# EasyEDA Pro project AT32M412_EVB.eprj, schematic Schematic1

## Sheets
1 PWR: Board Name: AT32M412_EVB; Create Date: 2025-06-04; Page Name: PWR; Project Name: AT32M412_EVB; Schematic Name: Schematic1; Update Date: 2025-11-24; Company: 嘉立创EDA; Page Size: A4; Version: V1.0
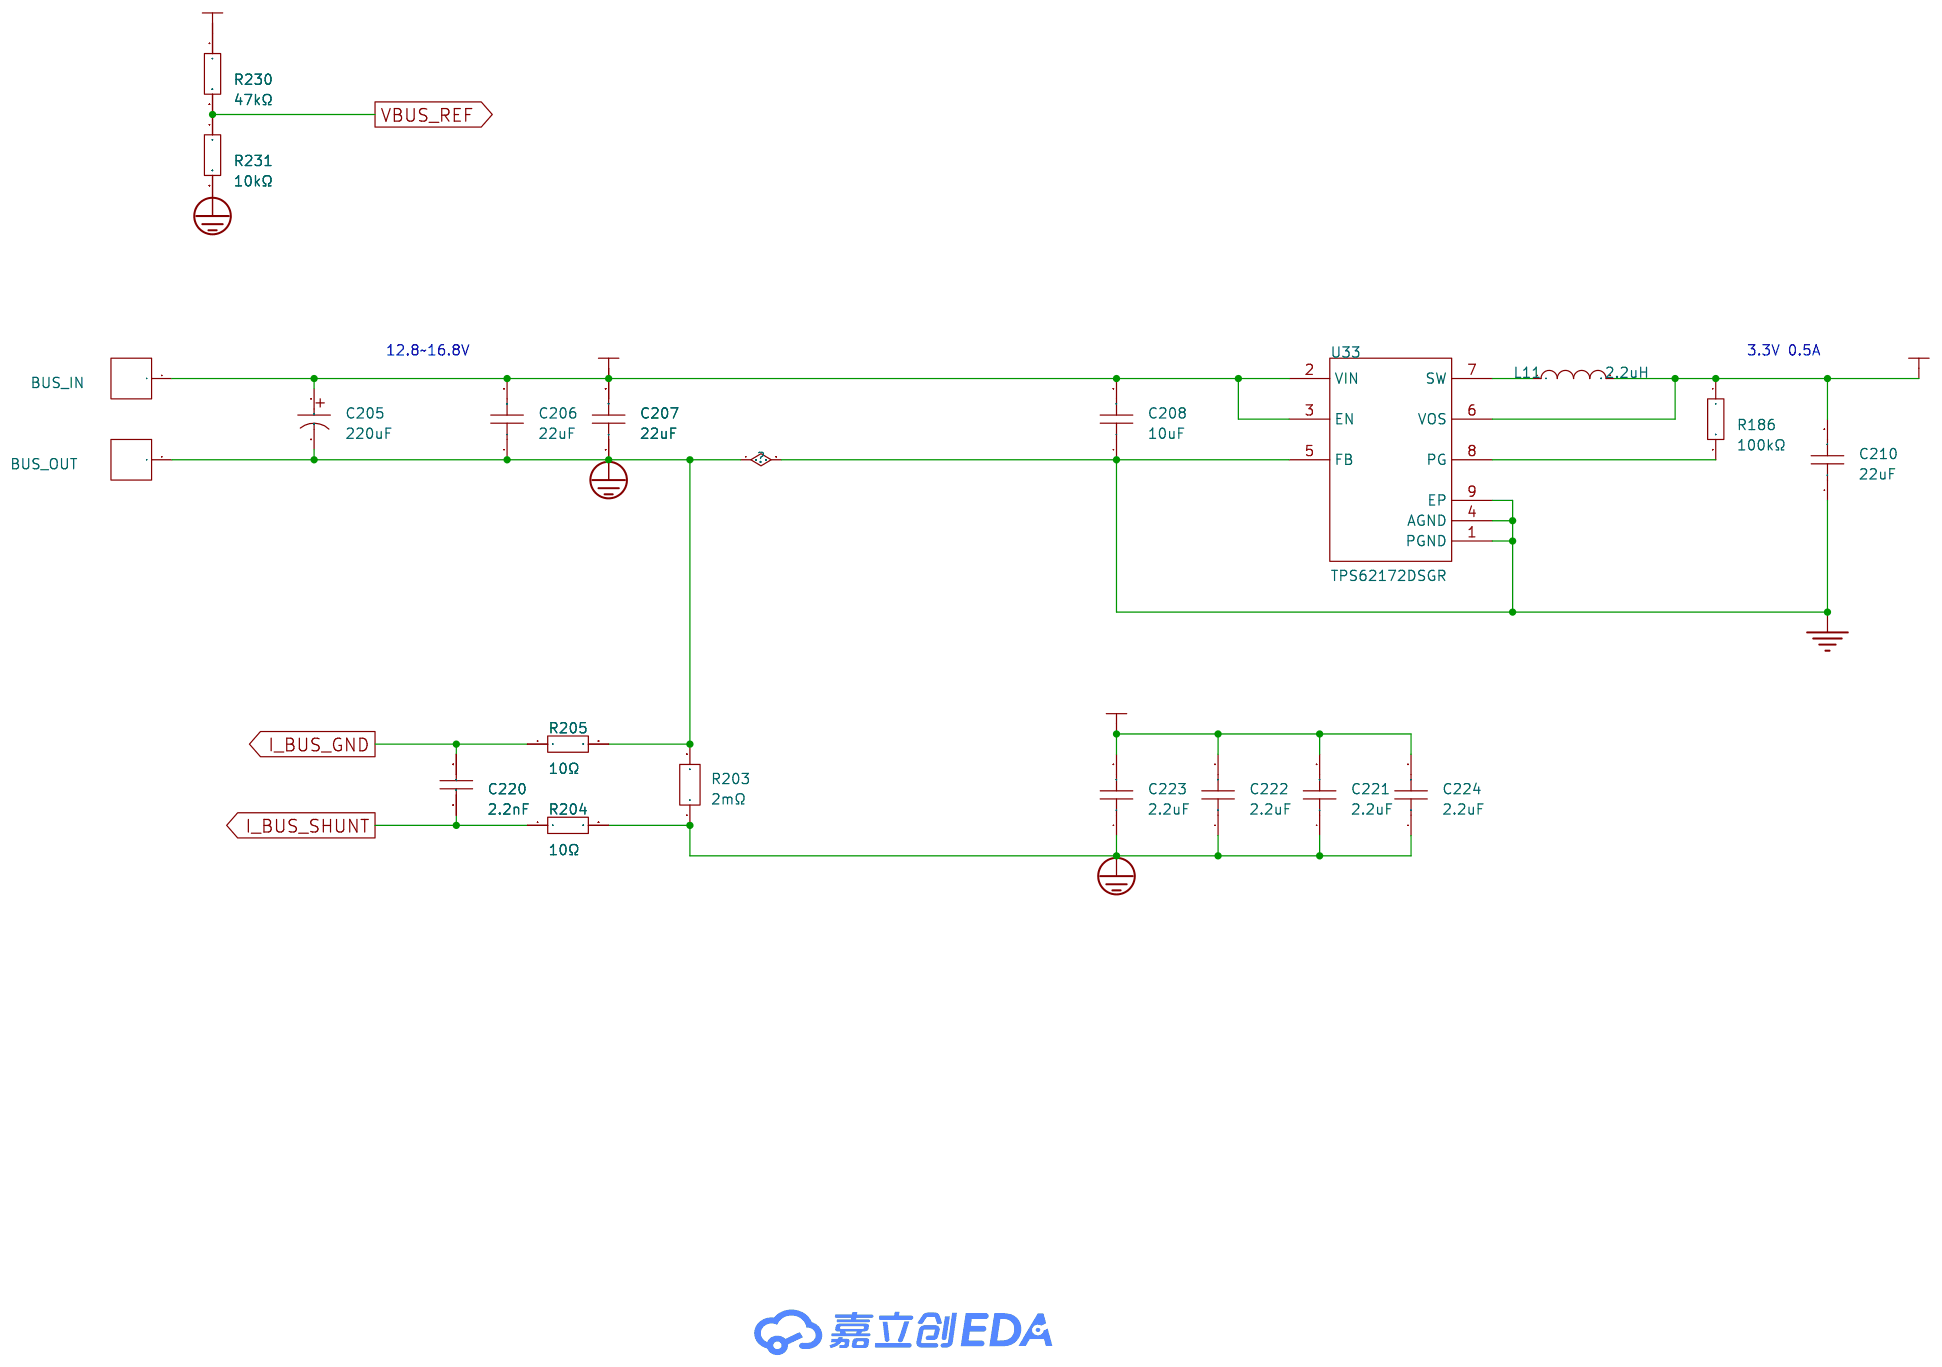
[diagram p0: PWR]
2 MCU: Page Name: MCU
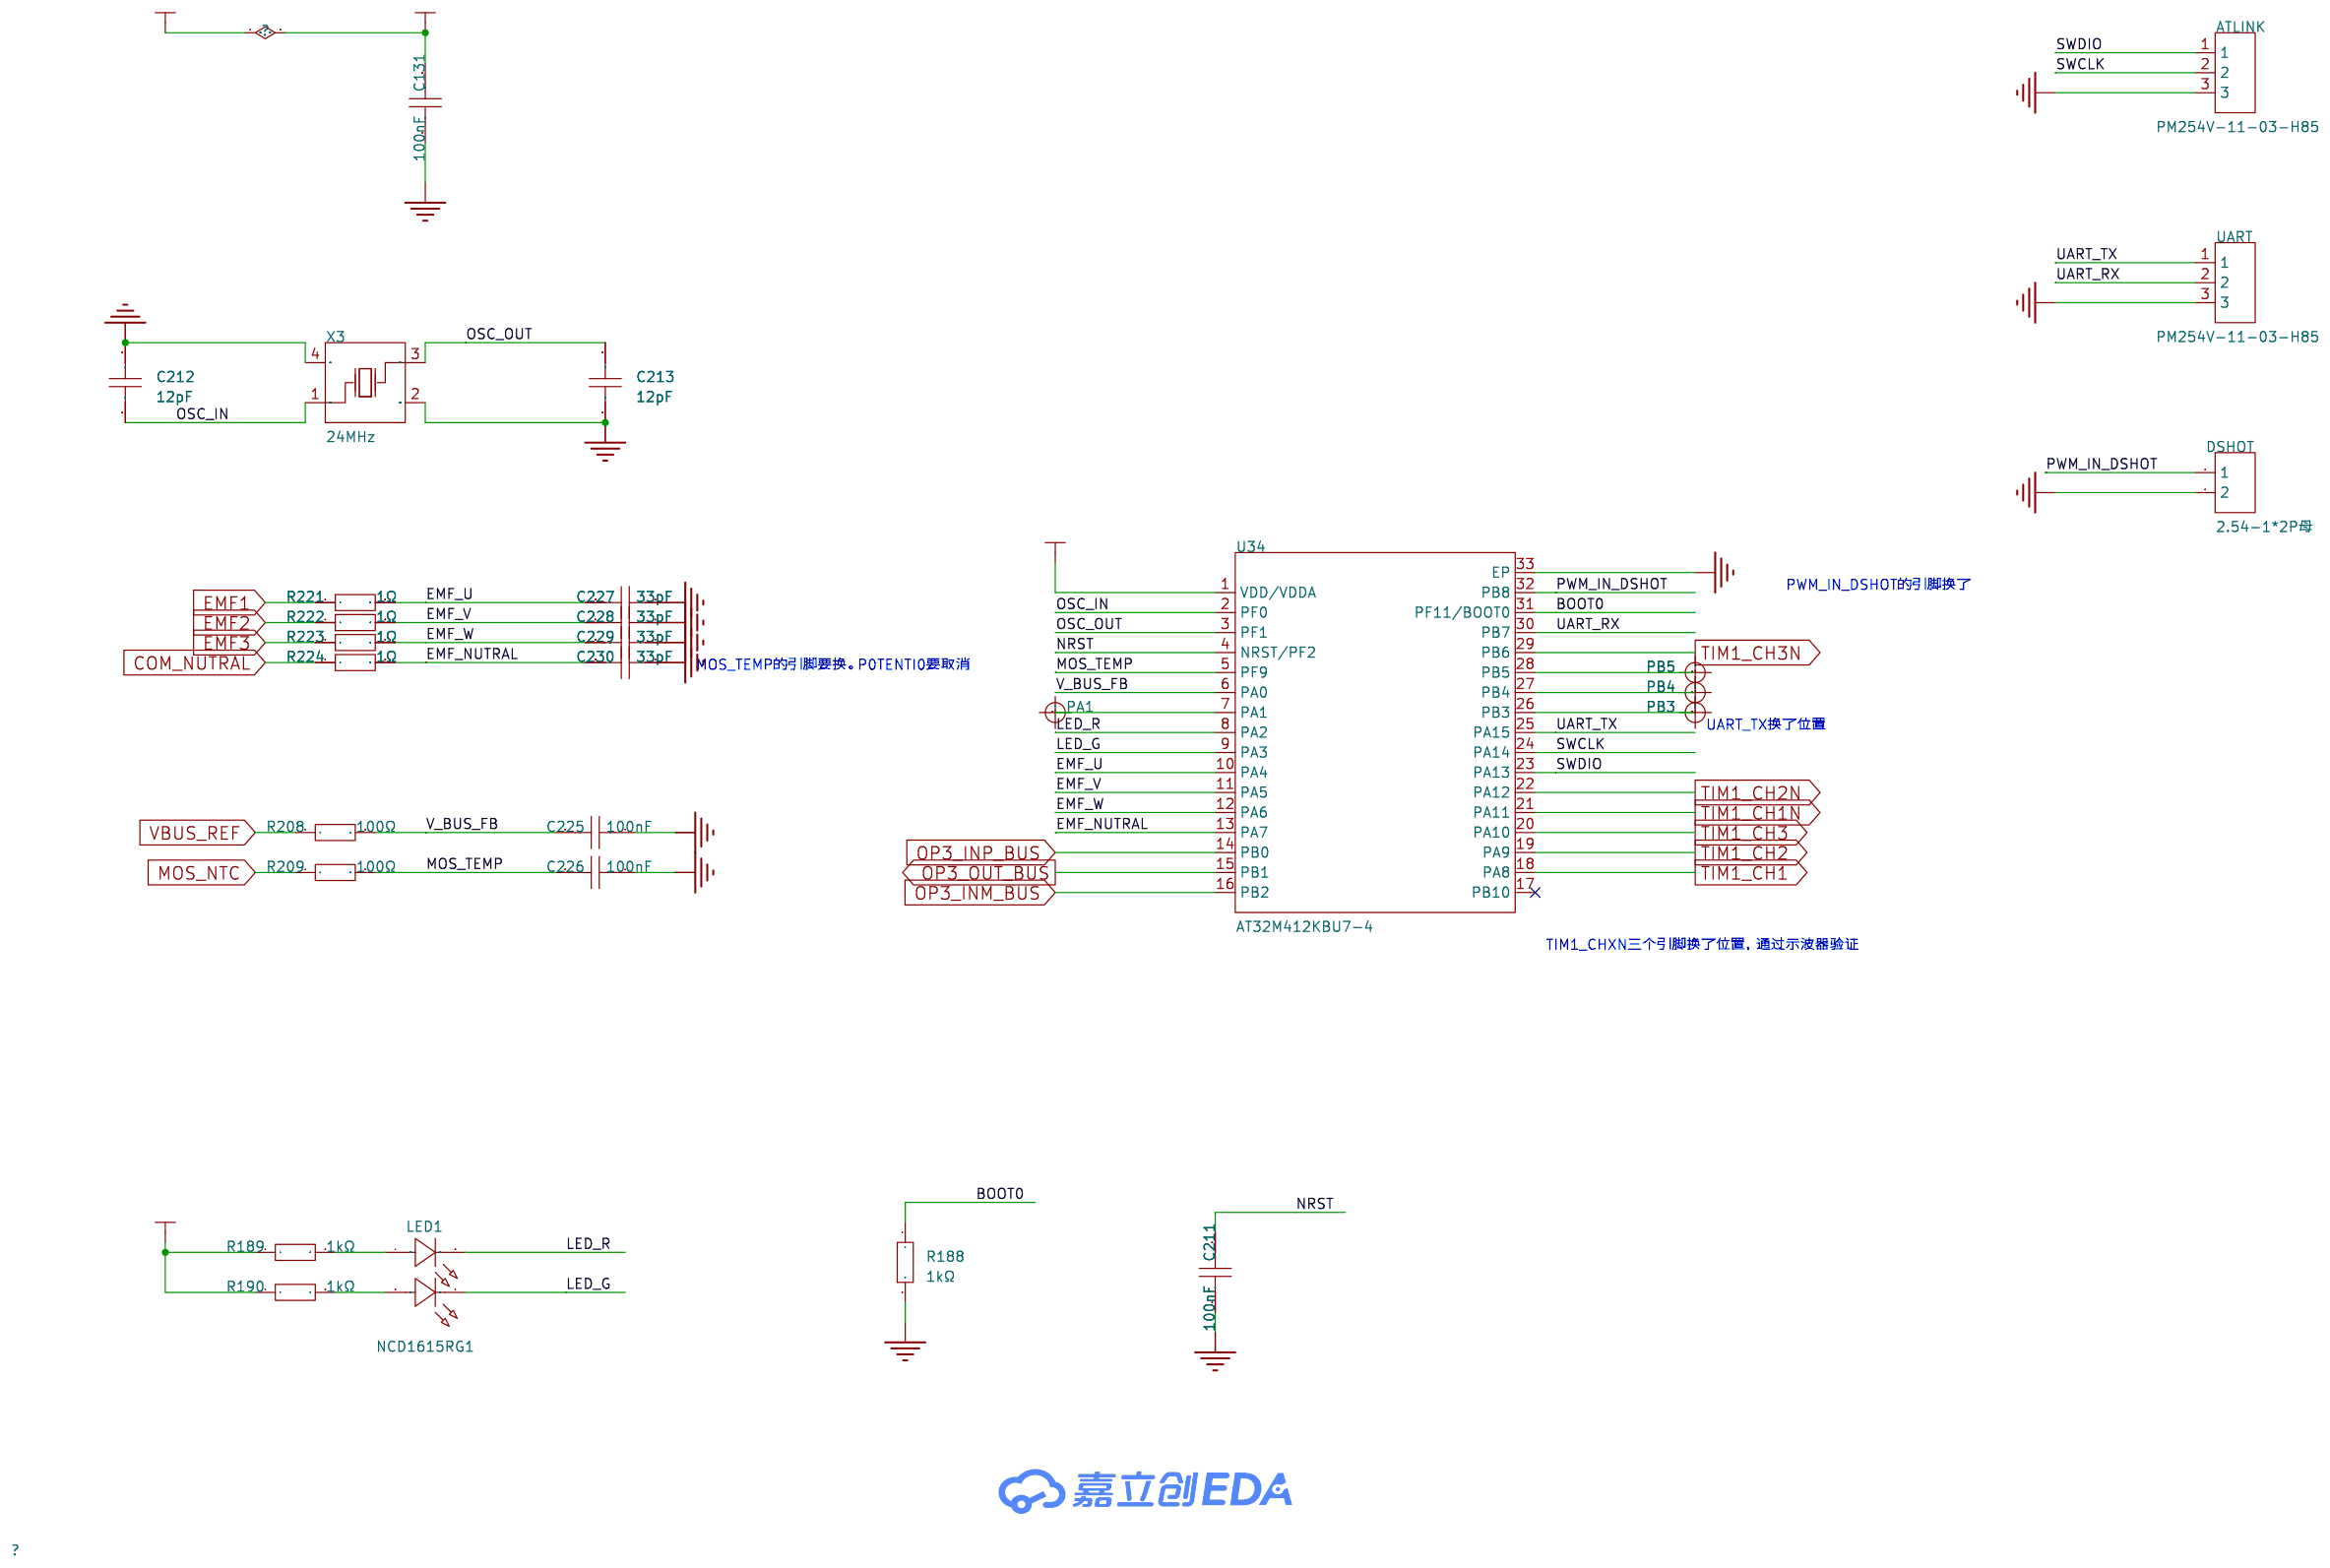
[diagram p1: MCU]
3 Driver: Create Date: 2025-10-28; Page Name: Driver
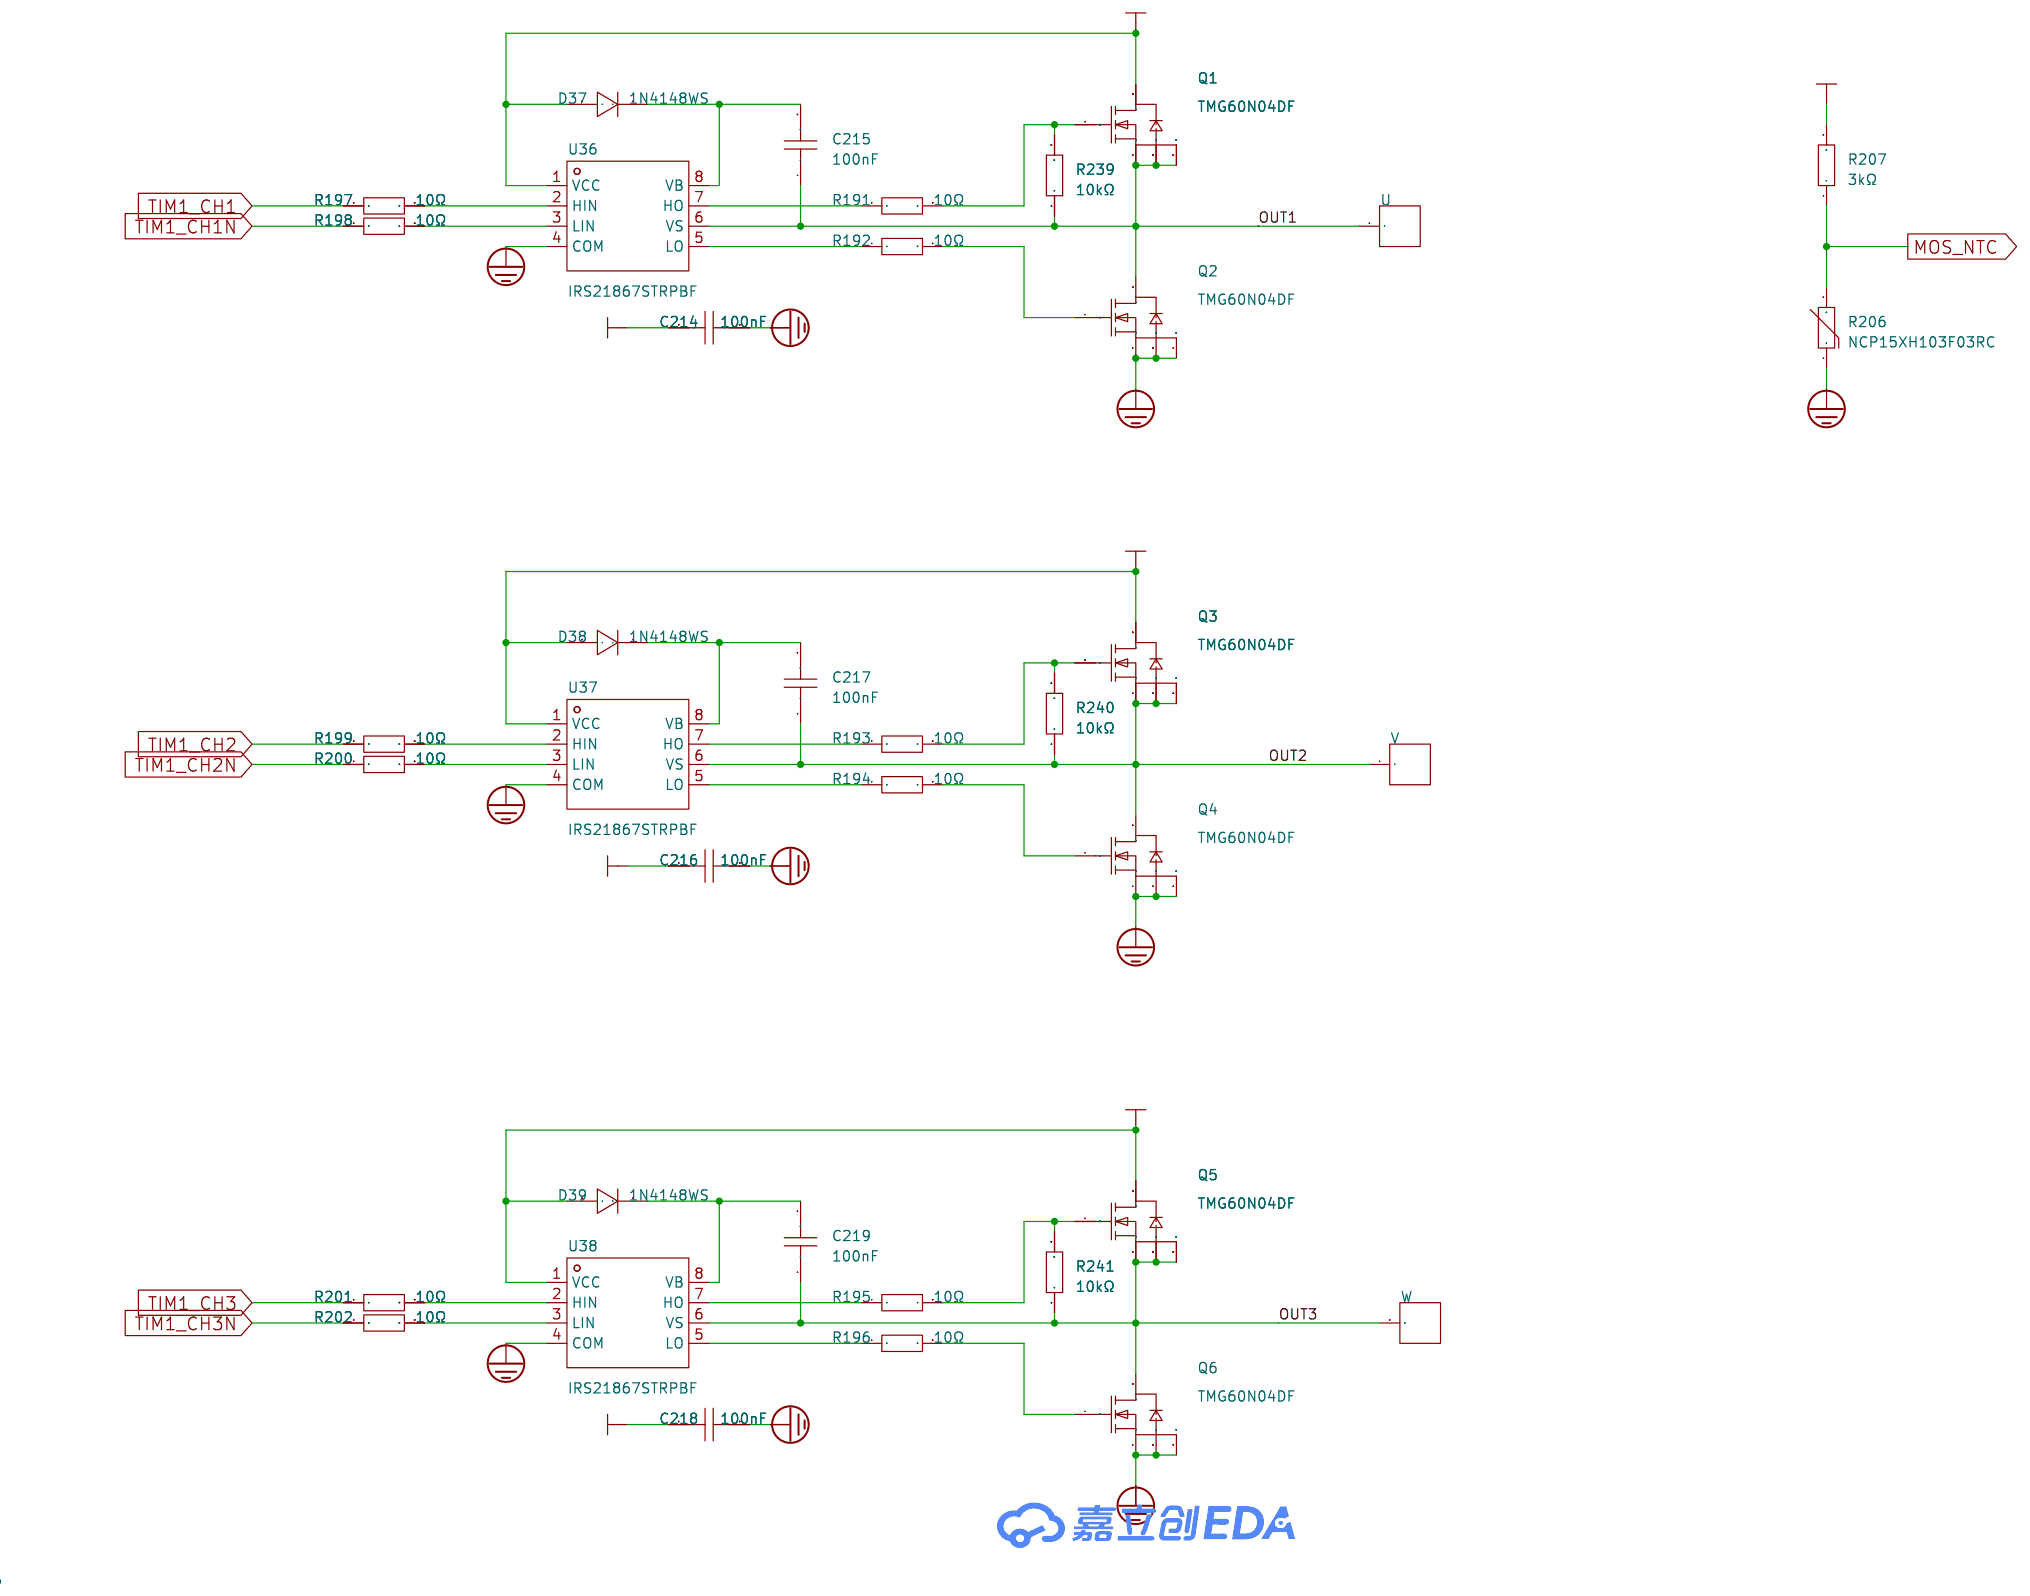
[diagram p2: Driver]
4 Sensing: Create Date: 2025-10-29; Page Name: Sensing; Update Date: 2025-10-30
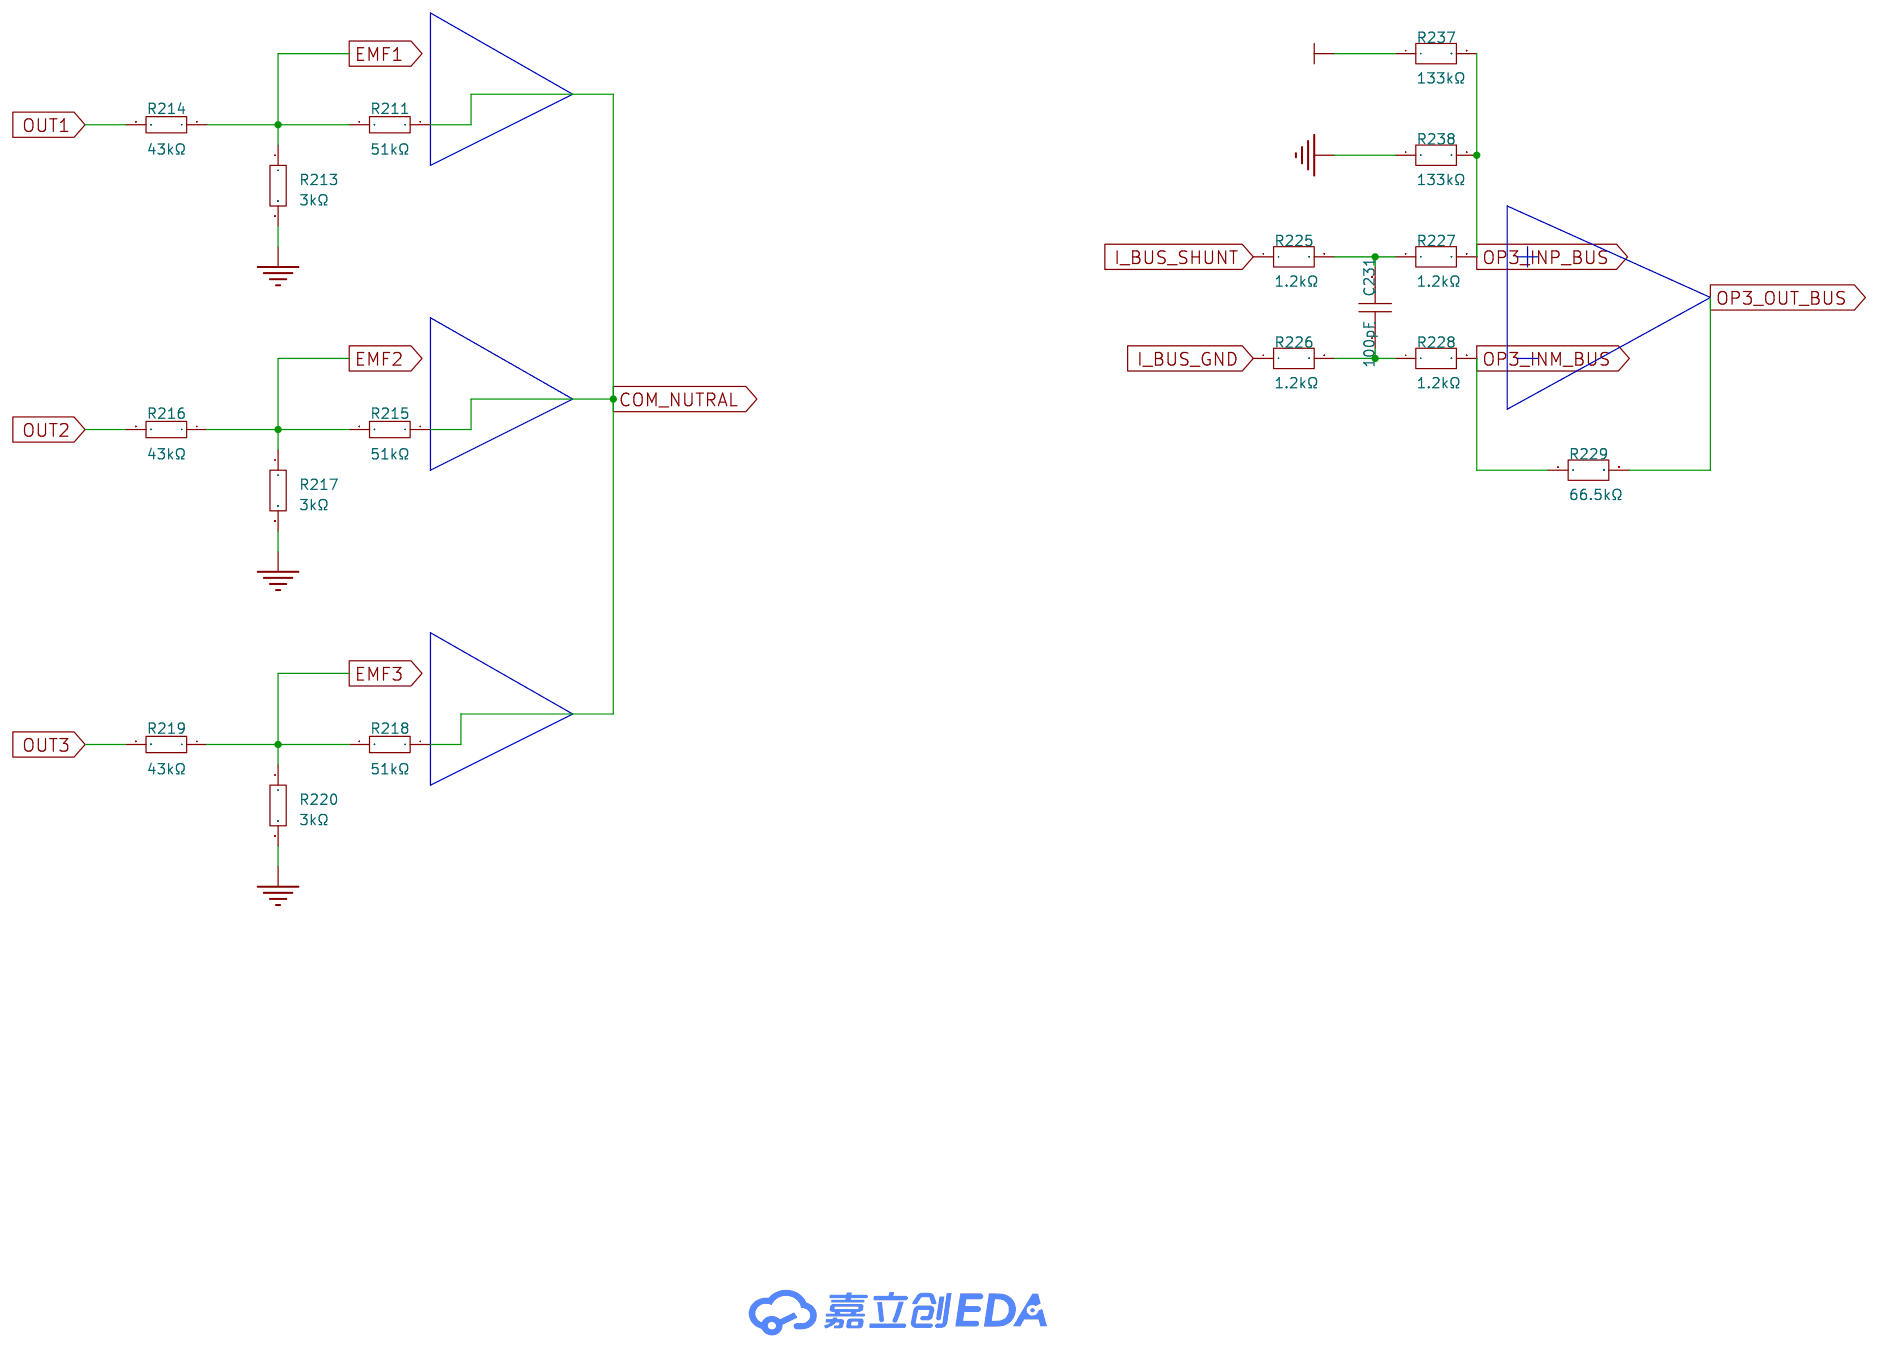
[diagram p3: Sensing]

## Parts
sheet Driver
C214  100nF  [C0402]
C215  100nF  [C0402]
C216  100nF  [C0402]
C217  100nF  [C0402]
C218  100nF  [C0402]
C219  100nF  [C0402]
D37  1N4148WS  [SOD-323_L1.8-W1.3-LS2.5-RD]
D38  1N4148WS  [SOD-323_L1.8-W1.3-LS2.5-RD]
D39  1N4148WS  [SOD-323_L1.8-W1.3-LS2.5-RD]
Q1  TMG60N04DF  [POWERDI3333-8_DMN7022LFGQ-7]
Q2  TMG60N04DF  [POWERDI3333-8_DMN7022LFGQ-7]
Q3  TMG60N04DF  [POWERDI3333-8_DMN7022LFGQ-7]
Q4  TMG60N04DF  [POWERDI3333-8_DMN7022LFGQ-7]
Q5  TMG60N04DF  [POWERDI3333-8_DMN7022LFGQ-7]
Q6  TMG60N04DF  [POWERDI3333-8_DMN7022LFGQ-7]
R191  10Ω  [R0402]
R192  10Ω  [R0402]
R193  10Ω  [R0402]
R194  10Ω  [R0402]
R195  10Ω  [R0402]
R196  10Ω  [R0402]
R197  10Ω  [R0402]
R198  10Ω  [R0402]
R199  10Ω  [R0402]
R200  10Ω  [R0402]
R201  10Ω  [R0402]
R202  10Ω  [R0402]
R206  NCP15XH103F03RC  [R0402]
R207  3kΩ  [R0402]
R239  10kΩ  [R0402]
R240  10kΩ  [R0402]
R241  10kΩ  [R0402]
U  -  [PAD_35A]
U36  IRS21867STRPBF  [SOIC-8_L5.0-W4.0-P1.27-LS6.0-BL]
U37  IRS21867STRPBF  [SOIC-8_L5.0-W4.0-P1.27-LS6.0-BL]
U38  IRS21867STRPBF  [SOIC-8_L5.0-W4.0-P1.27-LS6.0-BL]
V  -  [PAD_35A]
W  -  [PAD_35A]
sheet MCU
ATLINK  PM254V-11-03-H85  [HDR-TH_3P-P2.54-V-F]
C131  100nF  [C0402]
C211  100nF  [C0402]
C212  12pF  [C0402]
C213  12pF  [C0402]
C225  100nF  [C0402]
C226  100nF  [C0402]
C227  33pF  [C0402]
C228  33pF  [C0402]
C229  33pF  [C0402]
C230  33pF  [C0402]
DSHOT  2.54-1*2P母  [HDR-TH_2P-P2.54-V-F]
LED1  NCD1615RG1  [LED-SMD_4P-L1.6-W1.5-TL-1]
PA1  -  [Mark-Point-1mm]  (no BOM)
PB3  -  [Mark-Point-1mm]  (no BOM)
PB4  -  [Mark-Point-1mm]  (no BOM)
PB5  -  [Mark-Point-1mm]  (no BOM)
R188  1kΩ  [R0402]
R189  1kΩ  [R0402]
R190  1kΩ  [R0402]
R208  100Ω  [R0402]
R209  100Ω  [R0402]
R221  1Ω  [R0402]
R222  1Ω  [R0402]
R223  1Ω  [R0402]
R224  1Ω  [R0402]
U34  AT32M412KBU7-4  [WQFN-32_L4.0-W4.0-P0.40-TL-EP2.7]
UART  PM254V-11-03-H85  [HDR-TH_3P-P2.54-V-F]
X3  24MHz  [CRYSTAL-SMD_4P-L3.2-W2.5-BL]
sheet PWR
BUS_IN  -  [PAD_35A]
BUS_OUT  -  [PAD_35A]
C205  220uF  [CAP-TH_BD8.0-P3.50-D0.6-FD]
C206  22uF  [C0805]
C207  22uF  [C0805]
C208  10uF  [C0805]
C210  22uF  [C0402]
C220  2.2nF  [C0402]
C221  2.2uF  [C0603]
C222  2.2uF  [C0603]
C223  2.2uF  [C0603]
C224  2.2uF  [C0603]
L11  2.2uH  [IND-SMD_L2.5-W2.0_MHCHL2520]
R186  100kΩ  [R0402]
R203  2mΩ  [RES-SMD_L6.4-W3.2-1]
R204  10Ω  [R0402]
R205  10Ω  [R0402]
R230  47kΩ  [R0402]
R231  10kΩ  [R0402]
U33  TPS62172DSGR  [WSON-8_L2.0-W2.0-P0.50-TL-EP]
sheet Sensing
C231  100pF  [C0402]
R211  51kΩ  [R0402]
R213  3kΩ  [R0402]
R214  43kΩ  [R0402]
R215  51kΩ  [R0402]
R216  43kΩ  [R0402]
R217  3kΩ  [R0402]
R218  51kΩ  [R0402]
R219  43kΩ  [R0402]
R220  3kΩ  [R0402]
R225  1.2kΩ  [R0402]
R226  1.2kΩ  [R0402]
R227  1.2kΩ  [R0402]
R228  1.2kΩ  [R0402]
R229  66.5kΩ  [R0402]
R237  133kΩ  [R0402]
R238  133kΩ  [R0402]

## Library data of the parts
C214-C219 = CL05B104KB54PNC: LCSC Part Name: 100nF ±10% 50V; Supplier Part: C307331; Manufacturer: SAMSUNG(三星); Supplier Footprint: 0402; JLCPCB Part Class: 基础库; Datasheet: https://item.szlcsc.com/datasheet/CL05B104KB54PNC/291005.html; Supplier: LCSC; Tolerance: ±10%; Voltage Rating: 50V; Temperature Coefficient: X7R
D37-D39 = 1N4148WS_C2128: LCSC Part Name: 丝印T4 1N4148WS; Supplier Part: C2128; Manufacturer: CJ(江苏长电/长晶); Supplier Footprint: SOD-323; JLCPCB Part Class: 基础库; Datasheet: https://atta.szlcsc.com/upload/public/pdf/source/20140809/1457707208178.pdf; Supplier: LCSC; Diode Configuration: 独立式; Voltage - Forward(Vf@If): 1.25V@150mA; Voltage - DC Reverse(Vr): 100V; Current - Rectified: 150mA; Reverse Leakage Current (Ir): 1uA@75V; Reverse Recovery Time (trr): 4ns
Q1-Q6 = TMG60N04DF: LCSC Part Name: 1个N沟道 耐压:40V 电流:60A; Supplier Part: C7422898; Manufacturer: TMC(台懋); Supplier Footprint: PDFN3x3-8L; JLCPCB Part Class: 扩展库; Datasheet: https://item.szlcsc.com/datasheet/TMG60N04DF/8406147.html; Supplier: LCSC; Number: 1个N沟道; Drain to Source Voltage: 40V; Current - Continuous Drain(Id): 60A; RDS(on): 6.9mΩ@10V; Gate Threshold Voltage (Vgs(th)): 1.7V@250uA; Gate Charge(Qg): 5.8nC@4.5V; Input Capacitance(Ciss): 1.69nF; Reverse Transfer Capacitance (Crss@Vds): 38pF; Operating Temperature: -55℃~+150℃; Type: N沟道; Output Capacitance(Coss): 193pF
R191-R202 R204 R205 = 0402WGF100JTCE: 电阻类型:厚膜电阻;阻值:10Ω;精度:±1%;功率:62.5mW;工作电压:50V;温度系数:±200ppm/℃;; LCSC Part Name: 10Ω ±1% 62.5mW 厚膜电阻; Supplier Part: C25077; Manufacturer: UNI-ROYAL(厚声); Supplier Footprint: 0402; JLCPCB Part Class: Basic Part; Datasheet: https://item.szlcsc.com/datasheet/0402WGF100JTCE/25820.html; Supplier: LCSC; Type: 厚膜电阻; Tolerance: ±1%; Power(Watts): 62.5mW; Overload Voltage (Max): 50V; Temperature Coefficient: ±200ppm/℃; Operating Temperature Range: -55℃~+155℃; Voltage-Supply(Max): 50V; Operating Temperature: -55℃~+155℃
R206 = NCP15XH103F03RC: LCSC Part Name: 10kΩ 3380K 100mW; Supplier Part: C77131; Manufacturer: muRata(村田); Supplier Footprint: 0402; JLCPCB Part Class: 扩展库; Datasheet: https://item.szlcsc.com/datasheet/NCP15XH103F03RC/78258.html; Supplier: LCSC; Resistance @ 25℃: 10kΩ; B Constant (25℃/50℃): 3380K; Resistance Tolerance: ±1%; B Constant (25℃/85℃): 3434K; B Constant (25℃/100℃): 3455K; Power(Watts): 100mW; B Constant Tolerance: ±1%; Steady State Current (Max): 310uA; Operating Temperature: -40℃~+125℃; Dissipation Factor: 1mW/℃; Length: 1mm; Width: 0.5mm
R207 = 0402WGF3001TCE: LCSC Part Name: 3kΩ ±1% 62.5mW 厚膜电阻; Supplier Part: C25784; Manufacturer: UNI-ROYAL(厚声); Supplier Footprint: 0402; JLCPCB Part Class: Extended Part; Datasheet: https://atta.szlcsc.com/upload/public/pdf/source/20200306/C422600_1E6D84923E4A46A82E41ADD87F860B5C.pdf; Supplier: LCSC; Type: 厚膜电阻; Tolerance: ±1%; Power(Watts): 62.5mW; Overload Voltage (Max): 50V; Temperature Coefficient: ±100ppm/℃; Operating Temperature Range: -55℃~+155℃
R231 R239-R241 = 0402WGF1002TCE: 电阻类型:厚膜电阻;阻值:10kΩ;精度:±1%;功率:62.5mW;工作电压:50V;温度系数:±100ppm/℃;; LCSC Part Name: 10kΩ ±1% 62.5mW 厚膜电阻; Supplier Part: C25744; Manufacturer: UNI-ROYAL(厚声); Supplier Footprint: 0402; JLCPCB Part Class: Basic Part; Datasheet: https://item.szlcsc.com/datasheet/0402WGF1002TCE/26487.html; Supplier: LCSC; Type: 厚膜电阻; Tolerance: ±1%; Power(Watts): 62.5mW; Overload Voltage (Max): 50V; Temperature Coefficient: ±100ppm/℃; Operating Temperature Range: -55℃~+155℃; Voltage-Supply(Max): 50V; Operating Temperature: -55℃~+155℃
BUS_IN BUS_OUT U V W = PAD_35A: Supplier Footprint: 插件; Check: false
U36-U38 = IRS21867STRPBF: Supplier Part: C52290; Manufacturer: Infineon(英飞凌); Supplier Footprint: SOIC-8; JLCPCB Part Class: 扩展库; Datasheet: https://item.szlcsc.com/datasheet/IRS21867STRPBF/53304.html; Supplier: LCSC; Driven Configuration: 高边；低边; Load Type: IGBT；MOSFET; Number of Drivers: 2; Current - Output Low(IOL): 4A; Current - Output High(IOH): 4A; Voltage - Supply: 5V~20V; Rise Time: 22ns; Fall Time: 18ns; Propagation Delay tpLH: 170ns; Propagation Delay tpHL: 170ns; Features: 欠压保护(UVP); Operating Temperature: -40℃~+150℃@(Tj); Quiescent Current(Iq): 120uA
ATLINK UART = PM254V-11-03-H85: LCSC Part Name: 1x3P 间距:2.54mm 直插; Supplier Part: C541850; Manufacturer: XFCN(兴飞); Supplier Footprint: 插件,P=2.54mm; JLCPCB Part Class: Extended Part; Datasheet: https://item.szlcsc.com/datasheet/PM254V-11-03-H85/562471.html; Supplier: LCSC; Holes Structure: 1x3P; Pitch: 2.54mm; Circular Hole / Square Hole: 方孔; Mounting Type: 直插; Number of Rows: 单排; Number of Positions: 3P; Current Rating: 3A; Holes Direction: 顶部; Insulation Height: 8.5mm; Contact Material: 黄铜; Operating Temperature: -40℃~+105℃
C131 C211 C225 C226 = CL05B104KO5NNNC: 容值:100nF;精度:±10%;额定电压:16V;材质(温度系数):X7R;; LCSC Part Name: 100nF ±10% 16V; Supplier Part: C1525; Manufacturer: SAMSUNG(三星); Supplier Footprint: 0402; JLCPCB Part Class: Basic Part; Datasheet: https://atta.szlcsc.com/upload/public/pdf/source/20160218/1457707763339.pdf; Supplier: LCSC; Tolerance: ±10%; Voltage Rated: 16V; Temperature Coefficient: X7R
C212 C213 = 0402CG120J500NT: LCSC Part Name: 12pF ±5% 50V; Supplier Part: C1547; Manufacturer: FH(风华); Supplier Footprint: 0402; JLCPCB Part Class: Basic Part; Datasheet: https://item.szlcsc.com/datasheet/0402CG120J500NT/1899.html; Supplier: LCSC; Tolerance: ±5%; Voltage Rating: 50V; Temperature Coefficient: C0G
C227-C230 = 0402CG330J500NT: LCSC Part Name: 33pF ±5% 50V; Supplier Part: C1562; Manufacturer: FH(风华); Supplier Footprint: 0402; JLCPCB Part Class: Basic Part; Datasheet: https://item.szlcsc.com/datasheet/0402CG330J500NT/1914.html; Supplier: LCSC; Tolerance: ±5%; Voltage Rating: 50V; Temperature Coefficient: C0G
DSHOT = 2.54-1*2P母: LCSC Part Name: 1x2P 间距:2.54mm 直插; Supplier Part: C49661; Manufacturer: BOOMELE(博穆精密); Supplier Footprint: 插件,P=2.54mm; JLCPCB Part Class: Extended Part; Datasheet: https://item.szlcsc.com/datasheet/2.54-1*2P%25E6%25AF%258D/50669.html; Supplier: LCSC; Holes Structure: 1x2P; Pitch: 2.54mm; Circular Hole / Square Hole: 方孔; Mounting Type: 直插; Number of Rows: 单排; Number of Positions: 2P; Current Rating: 3A; Holes Direction: 顶部; Insulation Height: 3.3mm; Operating Temperature: -40℃~+105℃
LED1 = NCD1615RG1: LCSC Part Name: 片式发光二极管; Supplier Part: C2917181; Manufacturer: 国星光电; Supplier Footprint: SMD-4P,1.6x1.5mm; JLCPCB Part Class: 扩展库; Datasheet: https://item.szlcsc.com/datasheet/NCD1615RG1/3215920.html; Supplier: LCSC; Illumination Color: 橙红色,翠绿色; Voltage - Forward(Vf): 3.2V；2V; Power(Watts): 72mW；52mW; Forward Current: 20mA; Wavelength - Dominant: 625nm；525nm; Luminous Intensity: 260mcd；150mcd; Viewing Angle: 130°; Operating Temperature: -30℃~+85℃
PA1 PB3-PB5 = Mark-Point: Mark点
R188-R190 = 0402WGF1001TCE: 电阻类型:厚膜电阻;阻值:1kΩ;精度:±1%;功率:62.5mW;工作电压:50V;温度系数:±100ppm/℃;; LCSC Part Name: 1kΩ ±1% 62.5mW 厚膜电阻; Supplier Part: C11702; Manufacturer: UNI-ROYAL(厚声); Supplier Footprint: 0402; JLCPCB Part Class: Basic Part; Datasheet: https://item.szlcsc.com/datasheet/0402WGF1001TCE/12256.html; Supplier: LCSC; Type: 厚膜电阻; Tolerance: ±1%; Power(Watts): 62.5mW; Overload Voltage (Max): 50V; Temperature Coefficient: ±100ppm/℃; Operating Temperature Range: -55℃~+155℃; Voltage-Supply(Max): 50V; Operating Temperature: -55℃~+155℃
R208 R209 = 0402WGF1000TCE: LCSC Part Name: 100Ω ±1% 62.5mW 厚膜电阻; Supplier Part: C25076; Manufacturer: UNI-ROYAL(厚声); Supplier Footprint: 0402; JLCPCB Part Class: Basic Part; Datasheet: https://atta.szlcsc.com/upload/public/pdf/source/20200306/C422600_1E6D84923E4A46A82E41ADD87F860B5C.pdf; Supplier: LCSC; Type: 厚膜电阻; Tolerance: ±1%; Power(Watts): 62.5mW; Overload Voltage (Max): 50V; Temperature Coefficient: ±200ppm/℃; Operating Temperature Range: -55℃~+155℃
R221-R224 = 0402WGF100KTCE: LCSC Part Name: 1Ω ±1% 62.5mW 厚膜电阻; Supplier Part: C25086; Manufacturer: UNI-ROYAL(厚声); Supplier Footprint: 0402; JLCPCB Part Class: Extended Part; Datasheet: https://item.szlcsc.com/datasheet/0402WGF100KTCE/25829.html; Supplier: LCSC; Type: 厚膜电阻; Tolerance: ±1%; Power(Watts): 62.5mW; Voltage-Supply(Max): 50V; Temperature Coefficient: ±200ppm/℃; Operating Temperature: -55℃~+155℃
U34 = AT32M412KBU7-4: Supplier Part: C42410968; Manufacturer: ARTERY(雅特力); Supplier Footprint: QFN-32_4x4mm; JLCPCB Part Class: 扩展库; Datasheet: https://atta.szlcsc.com/upload/public/pdf/source/20250710/275EB83BD9923F6F1F7FFA3B8998FAE1.pdf; Supplier: LCSC
X3 = X322524MOB4SI: LCSC Part Name: YSX321SL 24MHZ 4P 3225 12PF ±10PPM -40~85℃ (±20PPM); Supplier Part: C70590; Manufacturer: YXC(扬兴晶振); Supplier Footprint: SMD3225-4P; JLCPCB Part Class: 扩展库; Datasheet: https://item.szlcsc.com/datasheet/X322524MOB4SI/71688.html; Supplier: LCSC; Type: 贴片晶振; Normal temperature Frequency Tolerance: ±10ppm; Load Capacitance: 12pF; Frequency Stability: ±20ppm; Operating Temperature: -40℃~+85℃
C205 = ERS1VM221F12OT: LCSC Part Name: 220uF ±20% 35V; Supplier Part: C106697; Manufacturer: AISHI(艾华集团); Supplier Footprint: 插件,D8xL12mm; JLCPCB Part Class: 扩展库; Datasheet: https://atta.szlcsc.com/upload/public/pdf/source/20191015/C438940_4B8E60A742BB0AE40DDEF87A5C89089D.pdf; Supplier: LCSC; Tolerance: ±20%; Rated Voltage: 35V; Lead Spacing: 3.5mm; φD: 8mm; L: 12mm; Lifetime @ Temp: 7000hrs@105℃
C206 C207 = CL21A226MAQNNNE: LCSC Part Name: 22uF ±20% 25V; Supplier Part: C45783; Manufacturer: SAMSUNG(三星); Supplier Footprint: 0805; JLCPCB Part Class: 基础库; Datasheet: https://item.szlcsc.com/datasheet/CL21A226MAQNNNE/46786.html; Supplier: LCSC; Tolerance: ±20%; Voltage Rating: 25V; Temperature Coefficient: X5R
C208 = CL21A106KAYNNNE_C15850: LCSC Part Name: 10uF ±10% 25V; Supplier Part: C15850; Manufacturer: SAMSUNG(三星); Manufacturer Part: CL21A106KAYNNNE; Supplier Footprint: 0805; JLCPCB Part Class: 基础库; Datasheet: https://item.szlcsc.com/datasheet/CL21A106KAYNNNE/16532.html; Supplier: LCSC; Tolerance: ±10%; Voltage Rating: 25V; Temperature Coefficient: X5R
C210 = GRM155R60J226ME11D: LCSC Part Name: 22uF ±20% 6.3V; Supplier Part: C415703; Manufacturer: muRata(村田); Supplier Footprint: 0402; JLCPCB Part Class: 扩展库; Datasheet: https://atta.szlcsc.com/upload/public/pdf/source/20200305/C490387_23319AE8C154DEB24C505E6C82A8106A.pdf; Supplier: LCSC; Tolerance: ±20%; Voltage Rating: 6.3V; Temperature Coefficient: X5R
C220 = 0402B222K500NT: LCSC Part Name: 2.2nF ±10% 50V; Supplier Part: C1531; Manufacturer: FH(风华); Supplier Footprint: 0402; JLCPCB Part Class: 扩展库; Datasheet: https://item.szlcsc.com/datasheet/0402B222K500NT/1883.html; Supplier: LCSC; Tolerance: ±10%; Voltage Rating: 50V; Temperature Coefficient: X7R
C221-C224 = CL10A225KB8NNNC: LCSC Part Name: 2.2uF ±10% 50V; Supplier Part: C913904; Manufacturer: SAMSUNG(三星); Supplier Footprint: 0603; JLCPCB Part Class: 扩展库; Datasheet: https://item.szlcsc.com/datasheet/CL10A225KB8NNNC/984470.html; Supplier: LCSC; Tolerance: ±10%; Voltage Rating: 50V; Temperature Coefficient: X5R
L11 = FTC252012S2R2MBCA: 电感值:2.2uH;精度:±20%;额定电流:3A;饱和电流(Isat):3.8A;类型:一体成型电感;; LCSC Part Name: 2.2uH ±20% 3.8A; Supplier Part: C5832372; Manufacturer: cjiang(长江微电); Supplier Footprint: 1008; JLCPCB Part Class: 扩展库; Datasheet: https://atta.szlcsc.com/upload/public/pdf/source/20230602/8FFEDA9C0247A92A0D4B67554BFE4091.pdf; Supplier: LCSC; Tolerance: ±20%; Rated Current: 3A; Saturation Current (Isat): 3.8A; DC Resistance (DCR): 55mΩ; Type: 一体成型电感
R186 = 0402WGF1003TCE: 电阻类型:厚膜电阻;阻值:100kΩ;精度:±1%;功率:62.5mW;工作电压:50V;温度系数:±100ppm/℃;; LCSC Part Name: 100kΩ ±1% 62.5mW 厚膜电阻; Supplier Part: C25741; Manufacturer: UNI-ROYAL(厚声); Supplier Footprint: 0402; JLCPCB Part Class: Basic Part; Datasheet: https://item.szlcsc.com/datasheet/0402WGF1003TCE/26484.html; Supplier: LCSC; Type: 厚膜电阻; Tolerance: ±1%; Power(Watts): 62.5mW; Overload Voltage (Max): 50V; Temperature Coefficient: ±100ppm/℃; Operating Temperature Range: -55℃~+155℃; Voltage-Supply(Max): 50V; Operating Temperature: -55℃~+155℃
R203 = HoLLR2512-3W-2mR-1%: LCSC Part Name: 2mΩ ±1% 3W; Supplier Part: C2994640; Manufacturer: Milliohm(毫欧); Supplier Footprint: 2512; JLCPCB Part Class: 扩展库; Datasheet: https://atta.szlcsc.com/upload/public/pdf/source/20220330/9E8D3880B1628B3B70C68092C8A7E08B.pdf; Supplier: LCSC; Type: 采样电阻; Tolerance: ±1%; Power(Watts): 3W; Rated Current: 77.5A; Temperature Coefficient: ±50ppm/℃; Mounting Sytle: 贴片
R230 = 0402WGF4702TCE: LCSC Part Name: 47kΩ ±1% 62.5mW 厚膜电阻; Supplier Part: C25792; Manufacturer: UNI-ROYAL(厚声); Supplier Footprint: 0402; JLCPCB Part Class: Basic Part; Datasheet: https://item.szlcsc.com/datasheet/0402WGF4702TCE/26535.html; Supplier: LCSC; Type: 厚膜电阻; Tolerance: ±1%; Power(Watts): 62.5mW; Voltage-Supply(Max): 50V; Temperature Coefficient: ±100ppm/℃; Operating Temperature: -55℃~+155℃
U33 = TPS62172DSGR: LCSC Part Name: 3-17V 0.5A 同步降压转换器; Supplier Part: C59873; Manufacturer: TI(德州仪器); Supplier Footprint: WSON-8-EP(2x2); JLCPCB Part Class: 扩展库; Datasheet: https://www.ti.com/cn/lit/gpn/tps62172; Supplier: LCSC; Function: 降压型; Output Type: 可调和固定; Input Voltage: 3V~17V; Output Voltage: 900mV~6V; Output Current: 500mA; Switching Frequency: 2.25MHz; Operating Temperature: -40℃~+85℃; Synchronous Rectification: 是; Number of Outputs: 1; Topology: 降压式; Quiescent Current (Iq): 17uA; Switch tube (built-in/external): 内置
C231 = 0402CG101J500NT: LCSC Part Name: 100pF ±5% 50V; Supplier Part: C1546; Manufacturer: FH(风华); Supplier Footprint: 0402; JLCPCB Part Class: Basic Part; Datasheet: https://atta.szlcsc.com/upload/public/pdf/source/20200305/C486355_26A10D38EF8C2A5C37091D0039909270.pdf; Supplier: LCSC; Tolerance: ±5%; Voltage Rated: 50V; Temperature Coefficient: C0G
R211 R215 R218 = 0402WGF5102TCE: LCSC Part Name: 51kΩ ±1% 62.5mW 厚膜电阻; Supplier Part: C25794; Manufacturer: UNI-ROYAL(厚声); Supplier Footprint: 0402; JLCPCB Part Class: Basic Part; Datasheet: https://atta.szlcsc.com/upload/public/pdf/source/20200306/C422600_1E6D84923E4A46A82E41ADD87F860B5C.pdf; Supplier: LCSC; Type: 厚膜电阻; Tolerance: ±1%; Power(Watts): 62.5mW; Overload Voltage (Max): 50V; Temperature Coefficient: ±100ppm/℃; Operating Temperature Range: -55℃~+155℃
R213 R217 R220 = FRC0402F3001TS: LCSC Part Name: 3kΩ ±1% 62.5mW 厚膜电阻; Supplier Part: C2909355; Manufacturer: FOJAN(富捷); Supplier Footprint: 0402; JLCPCB Part Class: Extended Part; Supplier: LCSC; Type: 厚膜电阻; Tolerance: ±1%; Power(Watts): 62.5mW; Voltage-Supply(Max): 50V; Temperature Coefficient: ±100ppm/℃; Operating Temperature: -55℃~+155℃
R214 R216 R219 = 0402WGF4302TCE: LCSC Part Name: 43kΩ ±1% 62.5mW 厚膜电阻; Supplier Part: C8329; Manufacturer: UNI-ROYAL(厚声); Supplier Footprint: 0402; JLCPCB Part Class: Extended Part; Datasheet: https://atta.szlcsc.com/upload/public/pdf/source/20200306/C422600_1E6D84923E4A46A82E41ADD87F860B5C.pdf; Supplier: LCSC; Type: 厚膜电阻; Tolerance: ±1%; Power(Watts): 62.5mW; Overload Voltage (Max): 50V; Temperature Coefficient: ±100ppm/℃; Operating Temperature Range: -55℃~+155℃
R225-R228 = RT0402BRD071K2L: LCSC Part Name: 薄膜电阻 1.2kΩ ±0.1% 63mW; Supplier Part: C852606; Manufacturer: YAGEO(国巨); Supplier Footprint: 0402; JLCPCB Part Class: 扩展库; Datasheet: https://item.szlcsc.com/datasheet/RT0402BRD071K2L/912928.html; Supplier: LCSC; Type: 薄膜电阻; Tolerance: ±0.1%; Power(Watts): 63mW; Voltage-Supply(Max): 50V; Temperature Coefficient: ±25ppm/℃; Operating Temperature: -55℃~+155℃
R229 = RT0402BRD0766K5L: LCSC Part Name: 薄膜电阻 66.5kΩ ±0.1% 62.5mW; Supplier Part: C852884; Manufacturer: YAGEO(国巨); Supplier Footprint: 0402; JLCPCB Part Class: 扩展库; Datasheet: https://item.szlcsc.com/datasheet/RT0402BRD0766K5L/913206.html; Supplier: LCSC; Type: 薄膜电阻; Tolerance: ±0.1%; Power(Watts): 62.5mW; Voltage-Supply(Max): 50V; Temperature Coefficient: ±25ppm/℃; Operating Temperature: -55℃~+155℃
R237 R238 = RT0402BRD07133KL: LCSC Part Name: 薄膜电阻 133kΩ ±0.1% 63mW; Supplier Part: C852517; Manufacturer: YAGEO(国巨); Supplier Footprint: 0402; JLCPCB Part Class: 扩展库; Datasheet: https://item.szlcsc.com/datasheet/RT0402BRD07133KL/912839.html; Supplier: LCSC; Type: 薄膜电阻; Tolerance: ±0.1%; Power(Watts): 63mW; Temperature Coefficient: ±25ppm/℃; Operating Temperature: -55℃~+155℃

## Nets
GND: ATLINK.3 BUS_OUT.1 C131.1 C205.2 C206.1 C207.1 C208.1 C210.1 C211.1 C212.2 C213.1 C225.1 C226.1 C227.1 C228.1 C229.1 C230.1 DSHOT.2 R188.2 R203.2 R205.2 R213.2 R217.2 R220.2 R231.2 R238.1 U33.1(PGND) U33.4(AGND) U33.5(FB) U33.9(EP) U34.33(EP) UART.3 X3.2(GND) X3.4(GND)
GNDP: C214.2 C216.2 C218.2 C221.1 C222.1 C223.1 C224.1 Q2.1(S) Q2.2(S) Q2.3(S) Q4.1(S) Q4.2(S) Q4.3(S) Q6.1(S) Q6.2(S) Q6.3(S) R203.1 R204.2 R206.1 U36.4(COM) U37.4(COM) U38.4(COM)
VBUS: BUS_IN.1 C205.1 C206.2 C207.2 C208.2 C214.1 C216.1 C218.1 C221.2 C222.2 C223.2 C224.2 D37.2(A) D38.2(A) D39.2(A) Q1.5(D) Q3.5(D) Q5.5(D) R230.1 U33.2(VIN) U33.3(EN) U36.1(VCC) U37.1(VCC) U38.1(VCC)
VBUS_REF: R208.1 R230.2 R231.1
VCC_3V3: C131.2 C210.2 L11.2 R186.1 R189.1 R190.1 R207.2 R237.1 U33.6(VOS) U34.1(VDD/VDDA)
BOOT0: R188.1 U34.31(PF11/BOOT0)
COM_NUTRAL: R211.1 R215.1 R218.1 R224.1
EMF1: R211.2 R213.1 R214.1 R221.1
EMF2: R215.2 R216.1 R217.1 R222.1
EMF3: R218.2 R219.1 R220.1 R223.1
EMF_NUTRAL: C230.2 R224.2 U34.13(PA7)
EMF_U: C227.2 R221.2 U34.10(PA4)
EMF_V: C228.2 R222.2 U34.11(PA5)
EMF_W: C229.2 R223.2 U34.12(PA6)
I_BUS_GND: C220.2 R205.1 R226.1
I_BUS_SHUNT: C220.1 R204.1 R225.1
LED_G: LED1.1(R-) U34.9(PA3)
LED_R: LED1.3(UG-) U34.8(PA2)
MOS_NTC: R206.2 R207.1 R209.1
MOS_TEMP: C226.2 R209.2 U34.5(PF9)
NRST: C211.2 U34.4(NRST/PF2)
OP3_INM_BUS: R228.2 R229.1 U34.16(PB2)
OP3_INP_BUS: R227.2 R237.2 R238.2 U34.14(PB0)
OP3_OUT_BUS: R229.2 U34.15(PB1)
OSC_IN: C212.1 U34.2(PF0) X3.1(OSC1)
OSC_OUT: C213.2 U34.3(PF1) X3.3(OSC2)
OUT1: C215.1 Q1.1(S) Q1.2(S) Q1.3(S) Q2.5(D) R214.2 R239.1 U.1 U36.6(VS)
OUT2: C217.1 Q3.1(S) Q3.2(S) Q3.3(S) Q4.5(D) R216.2 R240.1 U37.6(VS) V.1
OUT3: C219.1 Q5.1(S) Q5.2(S) Q5.3(S) Q6.5(D) R219.2 R241.1 U38.6(VS) W.1
PWM_IN_DSHOT: DSHOT.1 U34.32(PB8)
SWCLK: ATLINK.2 U34.24(PA14)
SWDIO: ATLINK.1 U34.23(PA13)
TIM1_CH1: R197.1 U34.18(PA8)
TIM1_CH1N: R198.1 U34.21(PA11)
TIM1_CH2: R199.1 U34.19(PA9)
TIM1_CH2N: R200.1 U34.22(PA12)
TIM1_CH3: R201.1 U34.20(PA10)
TIM1_CH3N: R202.1 U34.29(PB6)
UART_RX: U34.30(PB7) UART.2
UART_TX: U34.25(PA15) UART.1
V_BUS_FB: C225.2 R208.2 U34.6(PA0)
$1N4062: L11.1 U33.7(SW)
$1N4081: R186.2 U33.8(PG)
$2N17330: PA1.1 U34.7(PA1)
$2N18473: LED1.4(+UG) R189.2
$2N18489: LED1.2(+R) R190.2
$2N29618: PB5.1 U34.28(PB5)
$2N29622: PB4.1 U34.27(PB4)
$2N29627: PB3.1 U34.26(PB3)
$9N980: R191.1 U36.7(HO)
$9N1058: R192.1 U36.5(LO)
$9N1116: Q2.4(G) R192.2
$9N1462: C215.2 D37.1(K) U36.8(VB)
$9N2021: R193.1 U37.7(HO)
$9N2023: R194.1 U37.5(LO)
$9N2025: Q4.4(G) R194.2
$9N2053: C217.2 D38.1(K) U37.8(VB)
$9N2497: R195.1 U38.7(HO)
$9N2499: R196.1 U38.5(LO)
$9N2501: Q6.4(G) R196.2
$9N2529: C219.2 D39.1(K) U38.8(VB)
$9N2585: R197.2 U36.2(HIN)
$9N2628: R198.2 U36.3(LIN)
$9N2671: R199.2 U37.2(HIN)
$9N2714: R200.2 U37.3(LIN)
$9N2757: R201.2 U38.2(HIN)
$9N2800: R202.2 U38.3(LIN)
$9N15811: Q1.4(G) R191.2 R239.2
$9N15835: Q3.4(G) R193.2 R240.2
$9N15858: Q5.4(G) R195.2 R241.2
$10N1086: C231.1 R226.2 R228.1
$10N1091: C231.2 R225.2 R227.1

Not connected (* = marked no-connect by the designer): U34 17(PB10)*

## Notes on the sheets
sheet 1
- 12.8~16.8V
- 3.3V 0.5A
sheet 2
- PWM_IN_DSHOT的引脚换了
- MOS_TEMP的引脚要换。P0TENTI0要取消
- UART_TX换了位置
- TIM1_CHXN三个引脚换了位置，通过示波器验证
